# EAGLE design MOC30XX (EAGLE 5.08)
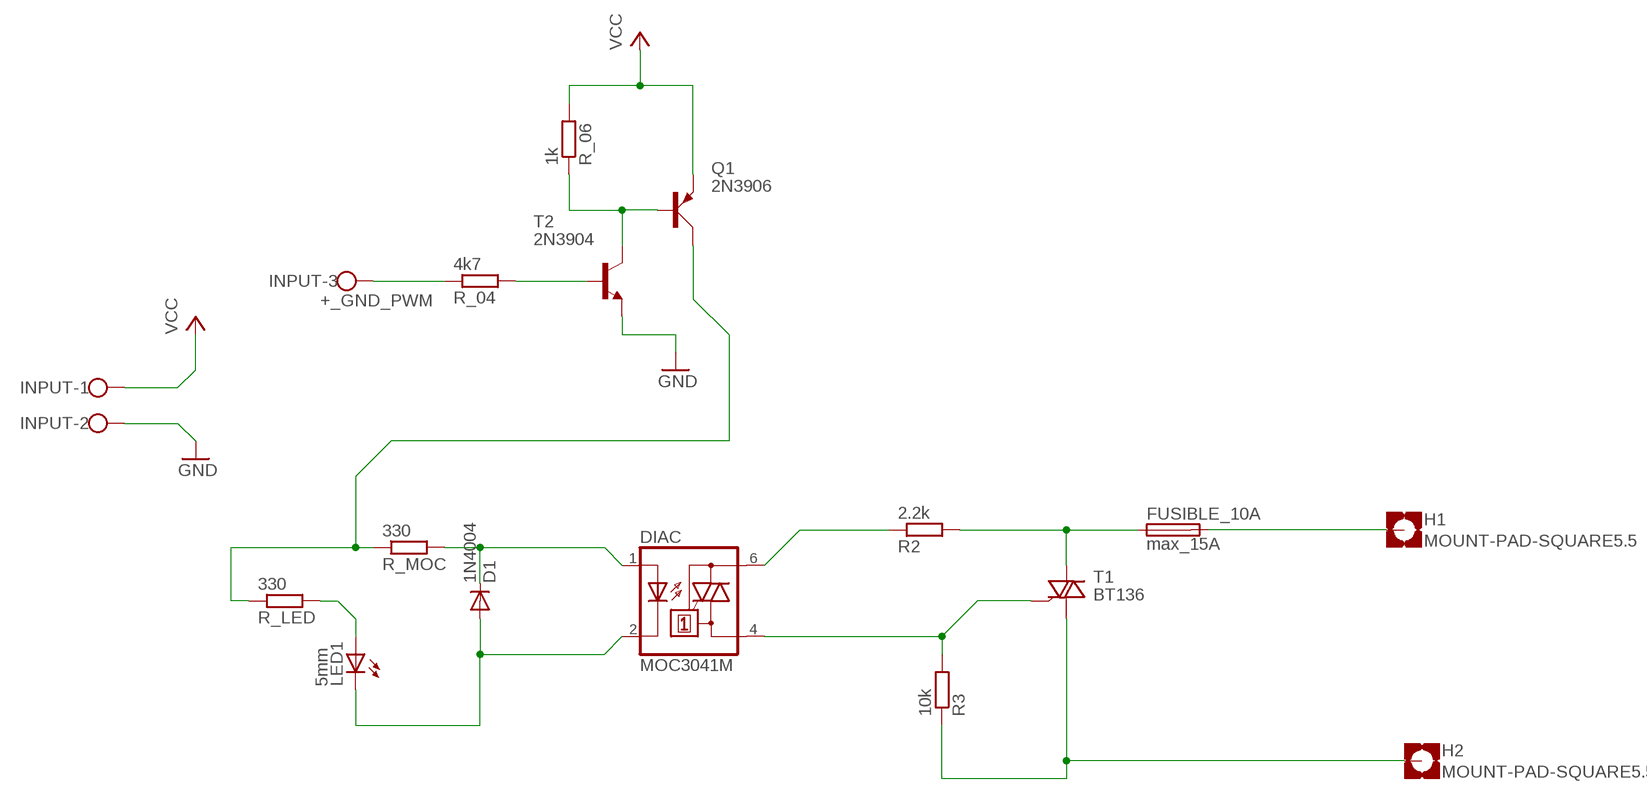
[diagram p0: schematic, sheet 1]

## Parts
D1  1N4004  [DO41-10]
DIAC  MOC3041M  [DIL06]
FUSIBLE_10A  max_15A  FUSEBLANK_5X20MM  [FUSE_HOLDER_5X20MM]
H1  MOUNT-PAD-SQUARE5.5  [5,5-PAD-SQUARE]
H2  MOUNT-PAD-SQUARE5.5  [5,5-PAD-SQUARE]
INPUT  +_GND_PWM  W237-103  [W237-103]
LED1  5mm  LED5MM  [LED5MM]
Q1  2N3906  [TO92D]
R2  2.2k  R-EU_0207/10  [0207/10]
R3  10k  R-EU_0207/10  [0207/10]
R_04  4k7  R-EU_0207/10  [0207/10]
R_06  1k  R-EU_0207/10  [0207/10]
R_LED  330  R-EU_0207/10  [0207/10]
R_MOC  330  R-EU_0207/10  [0207/10]
T1  BT136  [TO220AB]
T2  2N3904  [TO92]

## Nets
GND: INPUT.2 T2.3(E)
N$1: DIAC.4(A1) R3.2 T1.3(G)
N$2: H2.B5,5(MOUNT) R3.1 T1.1(A1)
N$3: DIAC.6(A2) R2.1
N$4: FUSIBLE_10A.1 R2.2 T1.2(A2)
N$5: D1.C DIAC.1(A) R_MOC.2
N$6: D1.A DIAC.2(C) LED1.K(C)
N$7: LED1.A R_LED.2
N$8: INPUT.3 R_04.1
N$9: Q1.C R_LED.1 R_MOC.1
N$10: Q1.B R_06.1 T2.1(C)
N$11: FUSIBLE_10A.2 H1.B5,5(MOUNT)
N$15: R_04.2 T2.2(B)
VCC: INPUT.1 Q1.E R_06.2

## Library data of the parts
D1 = diode:1N4004: DIODE general purpose rectifier, 1 A
DIAC = optocoupler:MOC30*: 6-Pin DIP Zero-Cross Optoisolators Triac Driver Output (250/400 Volt Peak) Source: http://www.fairchildsemi.com/ds/MO/MOC3043-M.pdf
FUSIBLE_10A = fuse:FUSE: Fuse
H1 H2 = holes:MOUNT-PAD-SQUARE: MOUNTING PAD, square
INPUT = con-wago-500:W237-103: WAGO SCREW CLAMP
LED1 = led:LED: LED OSRAM: - CHIPLED LG R971, LG N971, LY N971, LG Q971, LY Q971, LO R971, LY R971 LH N974, LH R974 LS Q976, LO Q976, LY Q976 LO Q996 - Hyper CHIPLED LW Q18S LB Q993, LB Q99A, LB R99A - SideLED LS A670, LO A670, LY A670, LG A670, LP A670 LB A673, LV A673, LT A673, LW A673 LH A674 LY A675 LS A676, LA A676, LO A676, LY A676, LW A676 LS A679, LY A679, LG A679 - Hyper Micro SIDELED® LS Y876, LA Y876, LO Y876, LY Y876 LT Y87S - SmartLED LW L88C, LW L88S LB L89C, LB L89S, LG L890 LS L89K, LO L89K, LY L89K LS L896, LA L896, LO L896, LY L896 - TOPLED LS T670, LO T670, LY T670, LG T670, LP T670 LSG T670, LSP T670, LSY T670, LOP T670, LYG T670 LG T671, LOG T671, LSG T671 LB T673, LV T673, LT T673, LW T673 LH T674 LS T676, LA T676, LO T676, LY T676, LB T676, LH T676, LSB T676, LW T676 LB T67C, LV T67C, LT T67C, LS T67K, LO T67K, LY T67K, LW E67C LS E67B, LA E67B, LO E67B, LY E67B, LB E67C, LV E67C, LT E67C LW T67C LS T679, LY T679, LG T679 LS T770, LO T770, LY T770, LG T770, LP T770 LB T773, LV T773, LT T773, LW T773 LH T774 LS E675, LA E675, LY E675, LS T675 LS T776, LA T776, LO T776, LY T776, LB T776 LHGB T686 LT T68C, LB T68C - Hyper Mini TOPLED® LB M676 - Mini TOPLED Santana® LG M470 LS M47K, LO M47K, LY M47K Source: http://www.osram.convergy.de LUXEON: - LUMILED® LXK2-PW12-R00, LXK2-PW12-S00, LXK2-PW14-U00, LXK2-PW14-V00 LXK2-PM12-R00, LXK2-PM12-S00, LXK2-PM14-U00 LXK2-PE12-Q00, LXK2-PE12-R00, LXK2-PE12-S00, LXK2-PE14-T00, LXK2-PE14-U00 LXK2-PB12-K00, LXK2-PB12-L00, LXK2-PB12-M00, LXK2-PB14-N00, LXK2-PB14-P00, LXK2-PB14-Q00 LXK2-PR12-L00, LXK2-PR12-M00, LXK2-PR14-Q00, LXK2-PR14-R00 LXK2-PD12-Q00, LXK2-PD12-R00, LXK2-PD12-S00 LXK2-PH12-R00, LXK2-PH12-S00 LXK2-PL12-P00, LXK2-PL12-Q00, LXK2-PL12-R00 Source: www.luxeon.com KINGBRIGHT: KA-3528ASYC Source: www.kingbright.com
Q1 = transistor-small-signal:2N3906: PNP TRANSISTOR
R2 R3 R_04 R_06 R_LED R_MOC = resistor:R-EU_: RESISTOR, European symbol
T1 = triac:BT136: Triac BT136 series E sensitive gate Source: http://www.nxp.com/acrobat_download/datasheets/BT136_SERIES_E_2.pdf
T2 = transistor:2N3904: NPN TRANSISTOR

## Board
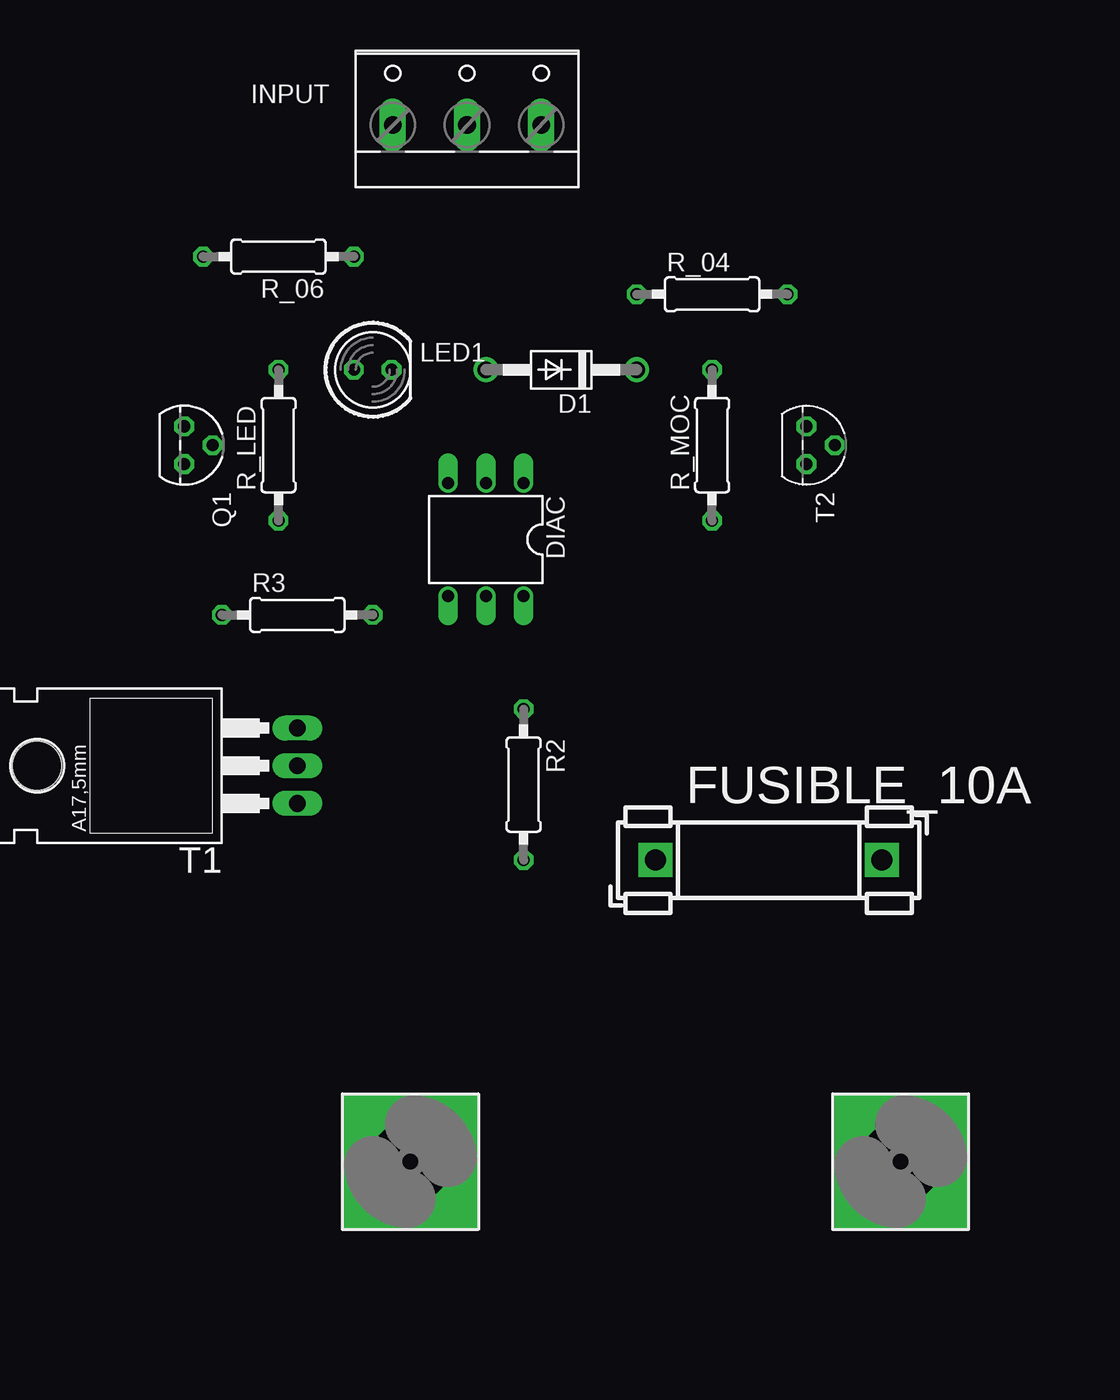
[diagram p1: board, top side]
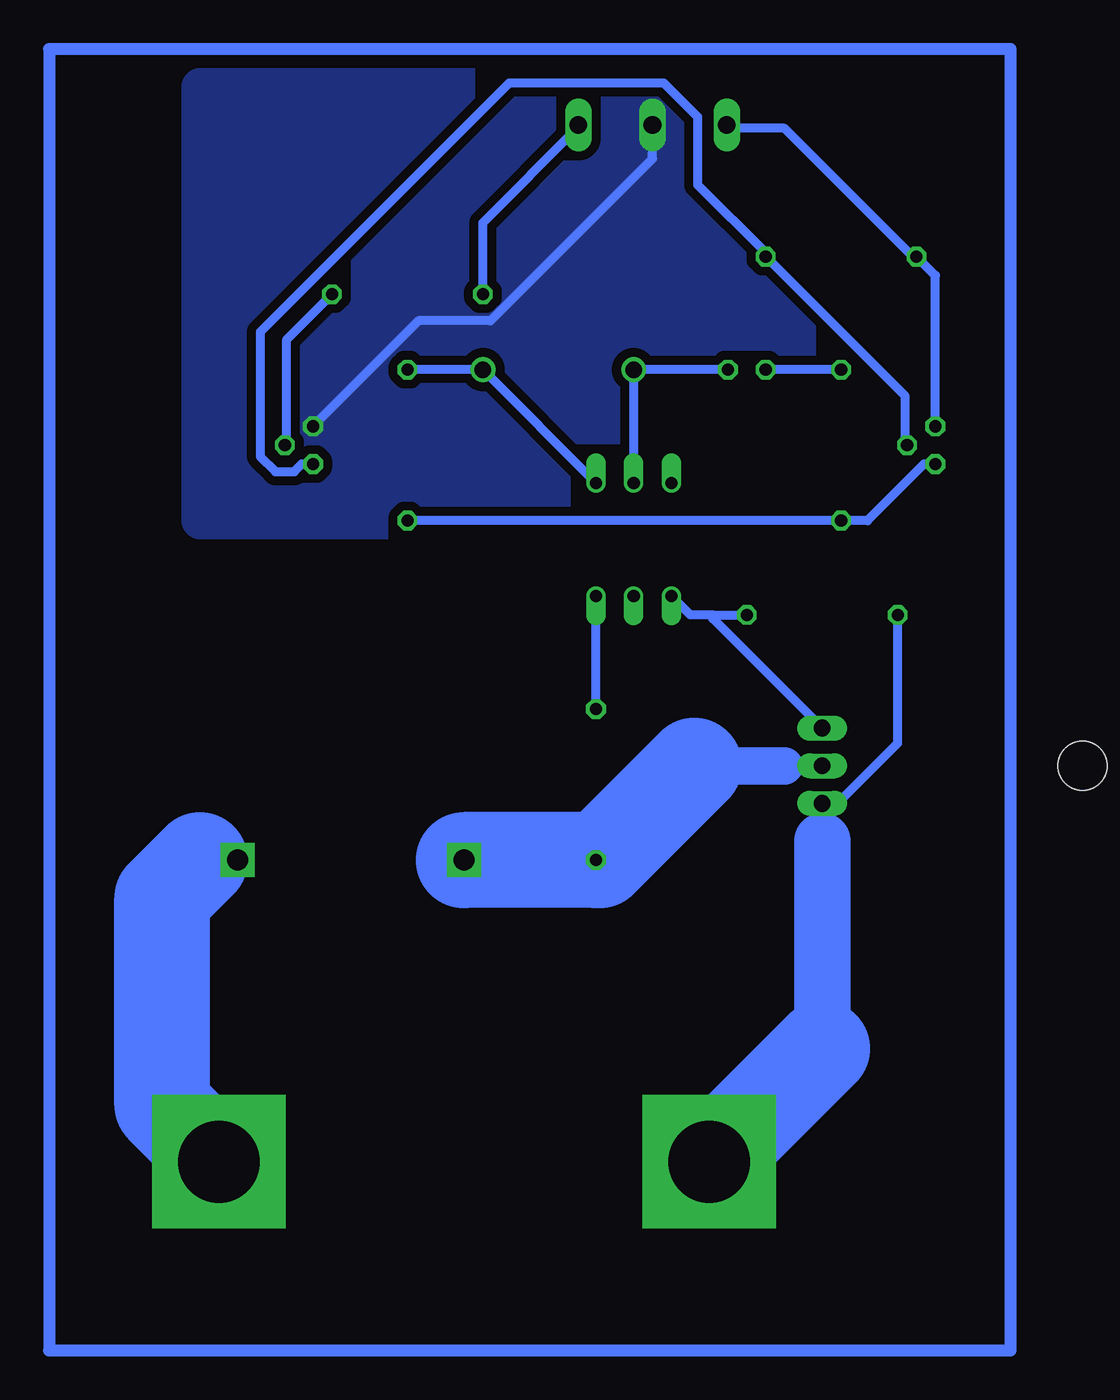
[diagram p2: board, bottom side, seen from below]

No outline drawn. Coordinates in mm, seen from the top.
Copper layers (1*16): Top 0.035mm / dielectric 1.5mm / Bottom 0.035mm
Design rules "default *": minimum track width 24mil, minimum drill 24mil, track to track 24mil, track to pad 24mil, pad to pad 24mil, via to via 24mil, smd to smd 8mil, copper to edge 40mil, drill to drill 8mil, minimum pad ring 10mil, minimum via ring 8mil, stop-mask expansion 4mil, vias tented up to drill 0mil, thermal gap 10mil

### Footprints (pad centres in the part's own frame; a part is rotated, then mirrored left to right if it is on the bottom)
DO41-10 = drill 1.118 round: A 5.08,0; C -5.08,0
DIL06 = drill 0.813 offset: 1 -2.54,-3.81; 2 0,-3.81; 3 2.54,-3.81; 4 2.54,3.81; 5 0,3.81; 6 -2.54,3.81
FUSE_HOLDER_5X20MM = drill 1.422 pad 2.286 square: 1 0,0; 2 15.24,0
5,5-PAD-SQUARE = drill 5.5 pad 9 square: B5,5 0,0
W237-103 = drill 1.194 long: 1 -5,-1.29; 2 0,-1.29; 3 5,-1.29
LED5MM = drill 0.813 octagon: A -1.27,0; K 1.27,0
TO92D = drill 0.813 octagon: B 0,1.905; C 1.27,0; E -1.27,0
0207/10 = drill 0.813 octagon: 1 -5.08,0; 2 5.08,0
TO220AB = drill 1.118 long: 1 -2.54,-6.35; 2 0,-6.35; 3 2.54,-6.35 | hole 3.302: 0,11.176
TO92 = drill 0.813 octagon: 1 1.27,0; 2 0,1.905; 3 -1.27,0

### Placement (x,y rotation side)
D1  25.4,66.04 180 top
DIAC  20.32,54.61 180 top
FUSIBLE_10A  31.75,33.02 0 top
H1  48.26,12.7 0 top
H2  15.24,12.7 0 top
INPUT  19.05,83.82 0 top
LED1  12.7,66.04 0 top
Q1  0,60.96 270 top
R2  22.86,38.1 270 top
R3  7.62,49.53 0 top
R_04  35.56,71.12 0 top
R_06  6.35,73.66 180 top
R_LED  6.35,60.96 90 top
R_MOC  35.56,60.96 90 top
T1  1.27,39.37 90 top
T2  41.91,60.96 270 top

### Tracks (layer width: path | path; a pad name or v marks a point on that pad's centre or on a via)
GND
  Bottom 0.61: T2.3 34.8,69.34 29.97,69.34 19.05,80.26 INPUT.2
  pour Bottom: -3.81,55.88 49.53,55.88 49.53,85.09 -3.81,85.09
N$1
  Bottom 0.61: 14.99,49.53 16.51,49.53 DIAC.4 | 14.99,49.53 R3.2 | T1.3 14.99,49.28 14.99,49.53
N$2
  Bottom 0.406: 7.62,34.29 T1.1
  Bottom 0.61: R3.1 2.54,40.89 6.6,36.83 T1.1
  Bottom 3.81: 7.62,20.32 7.62,34.29
  Bottom 6.452: H2.B5,5 7.62,20.32
N$3
  Bottom 0.61: R2.1 DIAC.6
N$4
  Bottom 0.61: T1.2 10.16,39.37 | 22.61,33.02 R2.2
  Bottom 2.54: 10.16,39.37 16.26,39.37
  Bottom 6.452: R2.2 FUSIBLE_10A.1 | 16.26,39.37 22.61,33.02
N$5
  Bottom 0.61: DIAC.1 D1.C R_MOC.2
N$6
  Bottom 0.61: LED1.K D1.A DIAC.2
N$7
  Bottom 0.61: R_LED.2 LED1.A
N$8
  Bottom 0.61: R_04.1 30.48,75.95 24.13,82.3 INPUT.3
N$9
  Bottom 0.61: Q1.C 0.76,59.69 4.57,55.88 R_LED.1 R_MOC.1
N$10
  Bottom 0.61: Q1.B 2.03,60.96 2.03,64.26 R_06.1 11.43,73.91 16,78.49 16,83.06 18.29,85.34 28.7,85.34 45.47,68.58 45.47,60.2 44.45,59.18 43.18,59.18 42.67,59.69 T2.1
N$11
  Bottom 0.406: 49.53,33.02 FUSIBLE_10A.2
  Bottom 6.452: 49.53,33.02 52.07,30.48 52.07,16.51 H1.B5,5
N$12
  Bottom 0.813: -5.08,0 -5.08,87.63 59.69,87.63 59.69,0 -5.08,0
N$15
  Bottom 0.61: R_04.2 43.69,68.07 43.69,60.96 T2.2
VCC
  Bottom 0.61: Q1.E 0,72.39 R_06.2 1.52,73.66 10.16,82.3 13.97,82.3 INPUT.1